# EAGLE design p0tx-001 (EAGLE 9.6.2)
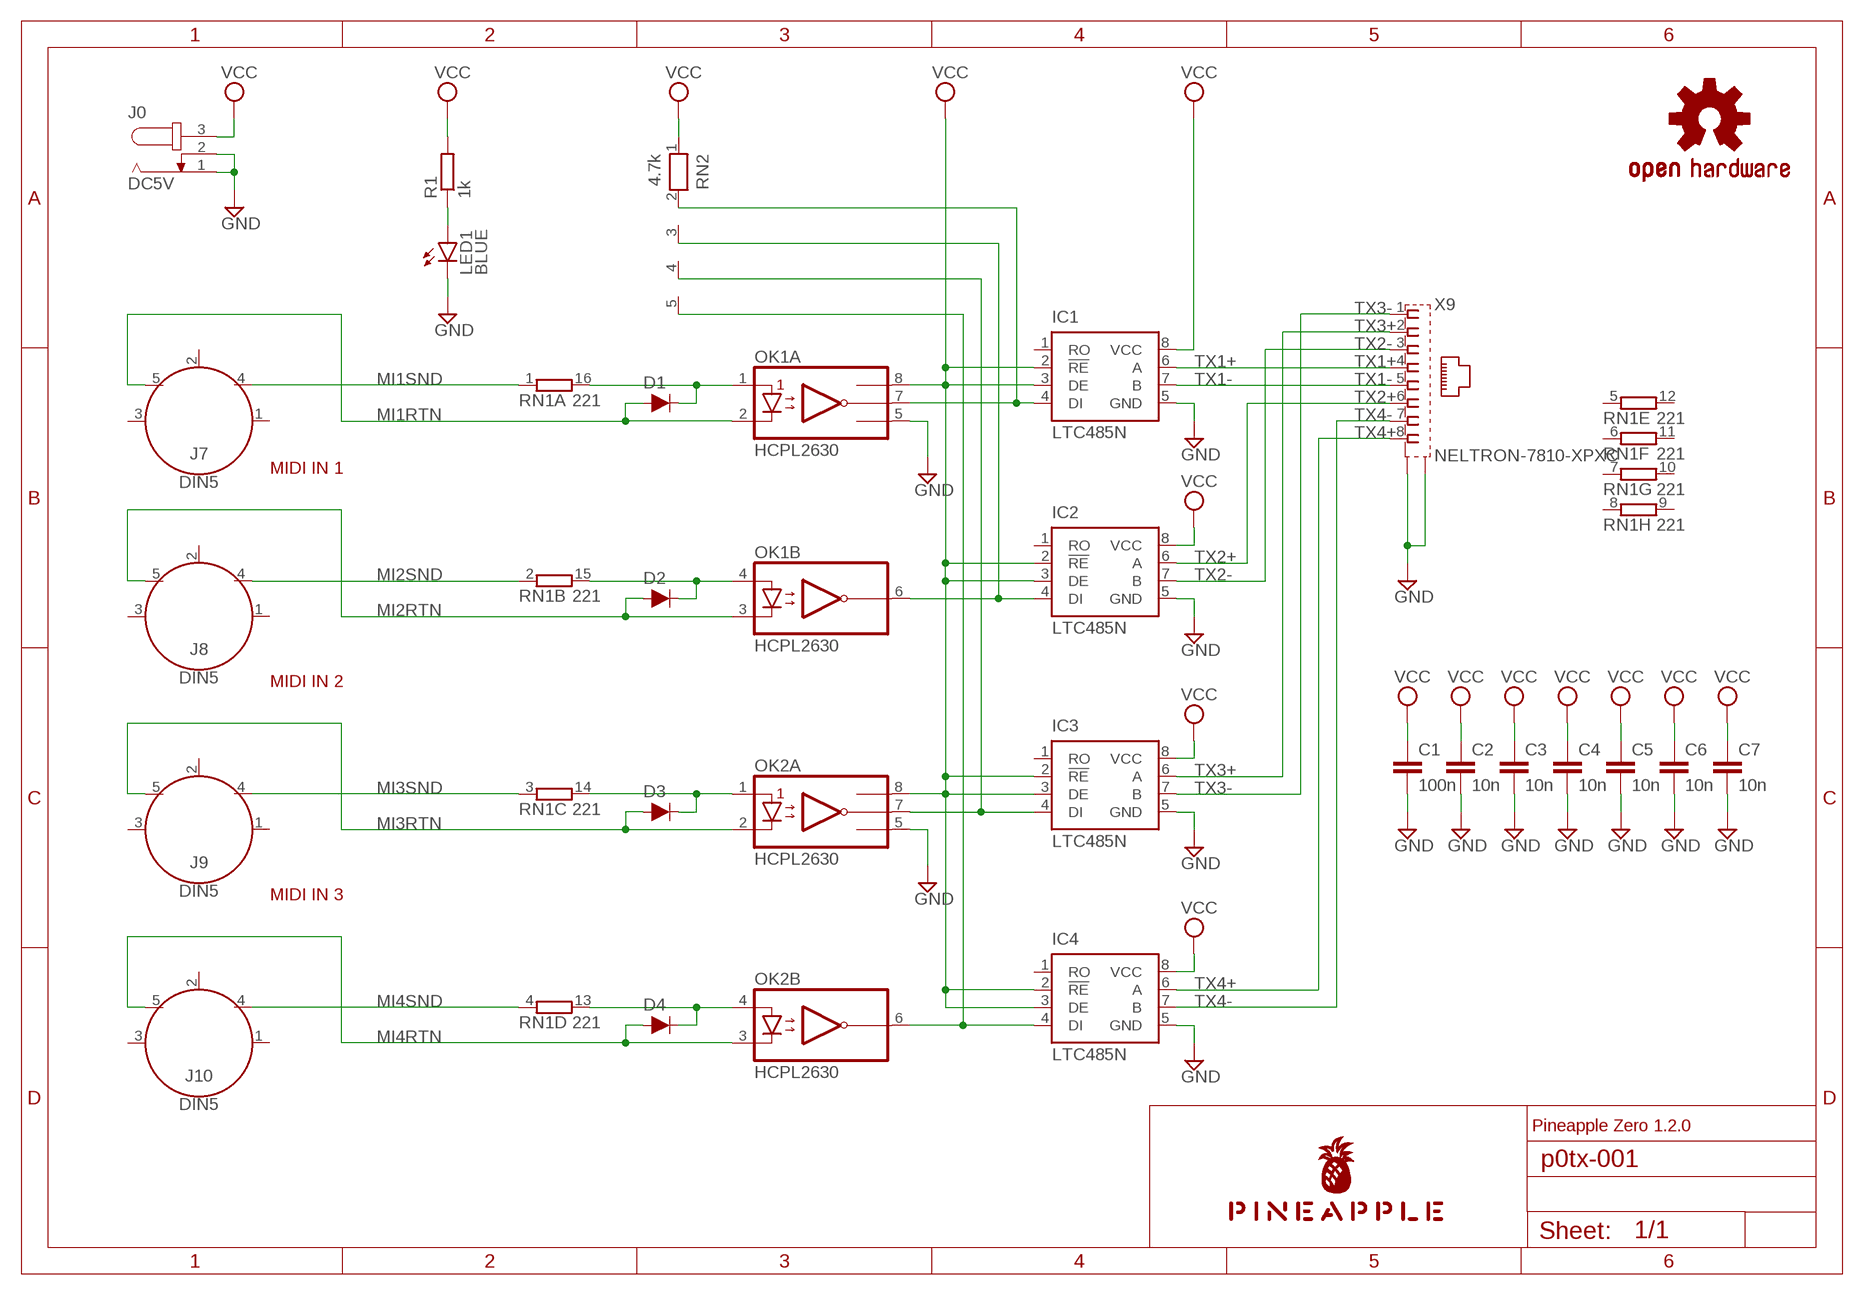
[diagram p0: schematic, sheet 1]

## Parts
C1  100n  C-EU025-024X044  [C025-024X044]
C2  10n  C-EU025-024X044  [C025-024X044]
C3  10n  C-EU025-024X044  [C025-024X044]
C4  10n  C-EU025-024X044  [C025-024X044]
C5  10n  C-EU025-024X044  [C025-024X044]
C6  10n  C-EU025-024X044  [C025-024X044]
C7  10n  C-EU025-024X044  [C025-024X044]
D1  DIODE-1N4148  [DIODE-1N4148]
D2  DIODE-1N4148  [DIODE-1N4148]
D3  DIODE-1N4148  [DIODE-1N4148]
D4  DIODE-1N4148  [DIODE-1N4148]
IC1  LTC485N  [DIL08]
IC2  LTC485N  [DIL08]
IC3  LTC485N  [DIL08]
IC4  LTC485N  [DIL08]
J0  DC5V  JACK-PLUG0  [SPC4077]
J7  DIN5  [DIN5-RA-PTH]
J8  DIN5  [DIN5-RA-PTH]
J9  DIN5  [DIN5-RA-PTH]
J10  DIN5  [DIN5-RA-PTH]
LED1  BLUE  LED3MM  [LED3MM]
LOGO1  OSHW-LOGOS-COPPER  [OSHW-LOGO-S_COPPER]
OK1  HCPL2630  [DIL08]
OK2  HCPL2630  [DIL08]
R1  1k  R-EU_0204/5  [0204/5]
RN1  221  8R-N  [DIL16]
RN2  4.7k  RN04  [RN-5]
U$1  PINEAPPLE450  [PINEAPPLE450]
X9  NELTRON-7810-XPXC  [NELTRON-7810-XPXC-FOOTPRINT]

## Nets
GND [gnd]: C1.2 C2.2 C3.2 C4.2 C5.2 C6.2 C7.2 IC1.5(GND) IC2.5(GND) IC3.5(GND) IC4.5(GND) J0.1 J0.2 LED1.K(C) OK1.5(A:GND) OK2.5(A:GND) X9.S1 X9.S2
MI1RTN: D1.A J7.5 OK1.2(A:C1)
MI1SND: J7.4 RN1.1
MI2RTN: D2.A J8.5 OK1.3(B:C2)
MI2SND: J8.4 RN1.2
MI3RTN: D3.A J9.5 OK2.2(A:C1)
MI3SND: J9.4 RN1.3
MI4RTN: D4.A J10.5 OK2.3(B:C2)
MI4SND: J10.4 RN1.4
MIDIIN: D1.C OK1.1(A:A1) RN1.16
N$1: D4.C OK2.4(B:A2) RN1.13
N$4: LED1.A R1.1
N$5: IC2.4(DI) OK1.6(B:VO2) RN2.3
N$6: IC4.4(DI) OK2.6(B:VO2) RN2.5
N$7: D2.C OK1.4(B:A2) RN1.15
N$8: D3.C OK2.1(A:A1) RN1.14
N$10: IC3.4(DI) OK2.7(A:VO1) RN2.4
TX: IC1.4(DI) OK1.7(A:VO1) RN2.2
TX1+: IC1.6(A) X9.4
TX1-: IC1.7(B) X9.5
TX2+: IC2.6(A) X9.6
TX2-: IC2.7(B) X9.3
TX3+: IC3.6(A) X9.2
TX3-: IC3.7(B) X9.1
TX4+: IC4.6(A) X9.8
TX4-: IC4.7(B) X9.7
VCC [pwr]: C1.1 C2.1 C3.1 C4.1 C5.1 C6.1 C7.1 IC1.2(!RE) IC1.3(DE) IC1.8(VCC) IC2.2(!RE) IC2.3(DE) IC2.8(VCC) IC3.2(!RE) IC3.3(DE) IC3.8(VCC) IC4.2(!RE) IC4.3(DE) IC4.8(VCC) J0.3 OK1.8(A:VCC) OK2.8(A:VCC) R1.2 RN2.1
Unconnected: IC1.1(RO) IC2.1(RO) IC3.1(RO) IC4.1(RO) J7.1 J7.2 J7.3 J8.1 J8.2 J8.3 J9.1 J9.2 J9.3 J10.1 J10.2 J10.3 RN1.5 RN1.6 RN1.7 RN1.8 RN1.9 RN1.10 RN1.11 RN1.12

## Notes on the sheet
- MIDI IN 1
- MIDI IN 2
- MIDI IN 3
- Pineapple Zero 1.2.0

## Library data of the parts
C1-C7 = rcl:C-EU: CAPACITOR, European symbol; SPICEPREFIX: C
D1-D4 = SparkFun-DiscreteSemi:DIODE: Diode These are standard reverse protection diodes and small signal diodes. SparkFun Products: SparkFun SparkPunk Sound Kit <https://www.sparkfun.com/products/11177> SparkFun ESP8266 Thing <https://www.sparkfun.com/products/13231>; PROD_ID: DIO-08378; VALUE: 200mA/100V/1V
IC1-IC4 = linear-technology:LTC485: Low Power RS485 Interface Transceiver Source: http://www.linear.com/pc/downloadDocument.do?navId=H0,C1,C1007,C1017,P2064,D1718; OC_FARNELL: unknown; OC_NEWARK: unknown
J0 = con-jack:JACK-PLUG: DC POWER JACK Power Jack, DC, Right Angle, Through Hole, Rated 5A at 16VDC, PC Terminals Distributor: Farnell (www.Farnell.de) Drawing: 84N1161.pdf / 84N1162.pdf Manufacturer: SPC Technology (www.spctechnology.com) Type: SPC4077 / SPC 4078; OC_FARNELL: unknown; OC_NEWARK: unknown
J7-J10 = SparkFun-Connectors:DIN5: DIN5 Connector - Female Right Angle (frequently used as a MIDI Jack connector) This type of connector and cable is frequently used for transmitting midi data (musical instrument digital interface). It is what you usually see on a keyboard or set of electronic drums. Learn more here <https://en.wikipedia.org/wiki/MIDI>. For more information on the pinout and electrical specifications of MIDI communications, please see the following resource: https://www.midi.org/specifications/item/midi-din-electrical-specification Here is the connector we sell at SparkFun: MIDI Connector - Female Right Angle <https://www.sparkfun.com/products/9536> (PRT-09536) Datasheet <hhttp://www.sparkfun.com/datasheets/Prototyping/Connectors/MIDI-RA.pdf> It is used on this SparkFun product: SparkFun MIDI Shield <https://www.sparkfun.com/products/12898> (DEV-12898); PROD_ID: CONN-09481
LED1 = led:LED: LED OSRAM: - CHIPLED LG R971, LG N971, LY N971, LG Q971, LY Q971, LO R971, LY R971 LH N974, LH R974 LS Q976, LO Q976, LY Q976 LO Q996 - Hyper CHIPLED LW Q18S LB Q993, LB Q99A, LB R99A - SideLED LS A670, LO A670, LY A670, LG A670, LP A670 LB A673, LV A673, LT A673, LW A673 LH A674 LY A675 LS A676, LA A676, LO A676, LY A676, LW A676 LS A679, LY A679, LG A679 - Hyper Micro SIDELED® LS Y876, LA Y876, LO Y876, LY Y876 LT Y87S - SmartLED LW L88C, LW L88S LB L89C, LB L89S, LG L890 LS L89K, LO L89K, LY L89K LS L896, LA L896, LO L896, LY L896 - TOPLED LS T670, LO T670, LY T670, LG T670, LP T670 LSG T670, LSP T670, LSY T670, LOP T670, LYG T670 LG T671, LOG T671, LSG T671 LB T673, LV T673, LT T673, LW T673 LH T674 LS T676, LA T676, LO T676, LY T676, LB T676, LH T676, LSB T676, LW T676 LB T67C, LV T67C, LT T67C, LS T67K, LO T67K, LY T67K, LW E67C LS E67B, LA E67B, LO E67B, LY E67B, LB E67C, LV E67C, LT E67C LW T67C LS T679, LY T679, LG T679 LS T770, LO T770, LY T770, LG T770, LP T770 LB T773, LV T773, LT T773, LW T773 LH T774 LS E675, LA E675, LY E675, LS T675 LS T776, LA T776, LO T776, LY T776, LB T776 LHGB T686 LT T68C, LB T68C - Hyper Mini TOPLED® LB M676 - Mini TOPLED Santana® LG M470 LS M47K, LO M47K, LY M47K Source: http://www.osram.convergy.de LUXEON: - LUMILED® LXK2-PW12-R00, LXK2-PW12-S00, LXK2-PW14-U00, LXK2-PW14-V00 LXK2-PM12-R00, LXK2-PM12-S00, LXK2-PM14-U00 LXK2-PE12-Q00, LXK2-PE12-R00, LXK2-PE12-S00, LXK2-PE14-T00, LXK2-PE14-U00 LXK2-PB12-K00, LXK2-PB12-L00, LXK2-PB12-M00, LXK2-PB14-N00, LXK2-PB14-P00, LXK2-PB14-Q00 LXK2-PR12-L00, LXK2-PR12-M00, LXK2-PR14-Q00, LXK2-PR14-R00 LXK2-PD12-Q00, LXK2-PD12-R00, LXK2-PD12-S00 LXK2-PH12-R00, LXK2-PH12-S00 LXK2-PL12-P00, LXK2-PL12-Q00, LXK2-PL12-R00 Source: www.luxeon.com KINGBRIGHT: KA-3528ASYC Source: www.kingbright.com
LOGO1 = SparkFun-Aesthetics:OSHW-LOGO: Open-Source Hardware (OSHW) Logo This logo indicates the piece of hardware it is found on incorporates a OSHW license and/or adheres to the definition of open source hardware found here: http://freedomdefined.org/OSHW
OK1 OK2 = optocoupler:HCPL2630: HEWLETT PACKARD OPTO COUPLER; MF: AGILENT TECHNOLOGIES; MPN: HCPL-2630-000E; OC_FARNELL: 9994904; OC_NEWARK: 88H7813
R1 = rcl:R-EU_: RESISTOR, European symbol; SPICEPREFIX: R
RN1 = resistor-dil:8R-N: DIL RESISTOR; OC_FARNELL: unknown; OC_NEWARK: unknown
RN2 = resistor-net:RN04: RESISTOR NETWORK; OC_FARNELL: unknown; OC_NEWARK: unknown
U$1 = pineapple:PINEAPPLE450
X9 = con-rj45:NELTRON-7810-XPXC: Mod. Jack, Right Angle, 8 posiotion, 8 contatcs RJ45 Source: GLX-S-88M.pdf

## Net classes
0 default: width 0.152 mm, drill 0.152 mm, clearance 0.152 mm
1 pwr: width 0.305 mm, drill 0.152 mm, clearance 0.152 mm
2 gnd: width 0.305 mm, drill 0.152 mm, clearance 0.152 mm

## Board
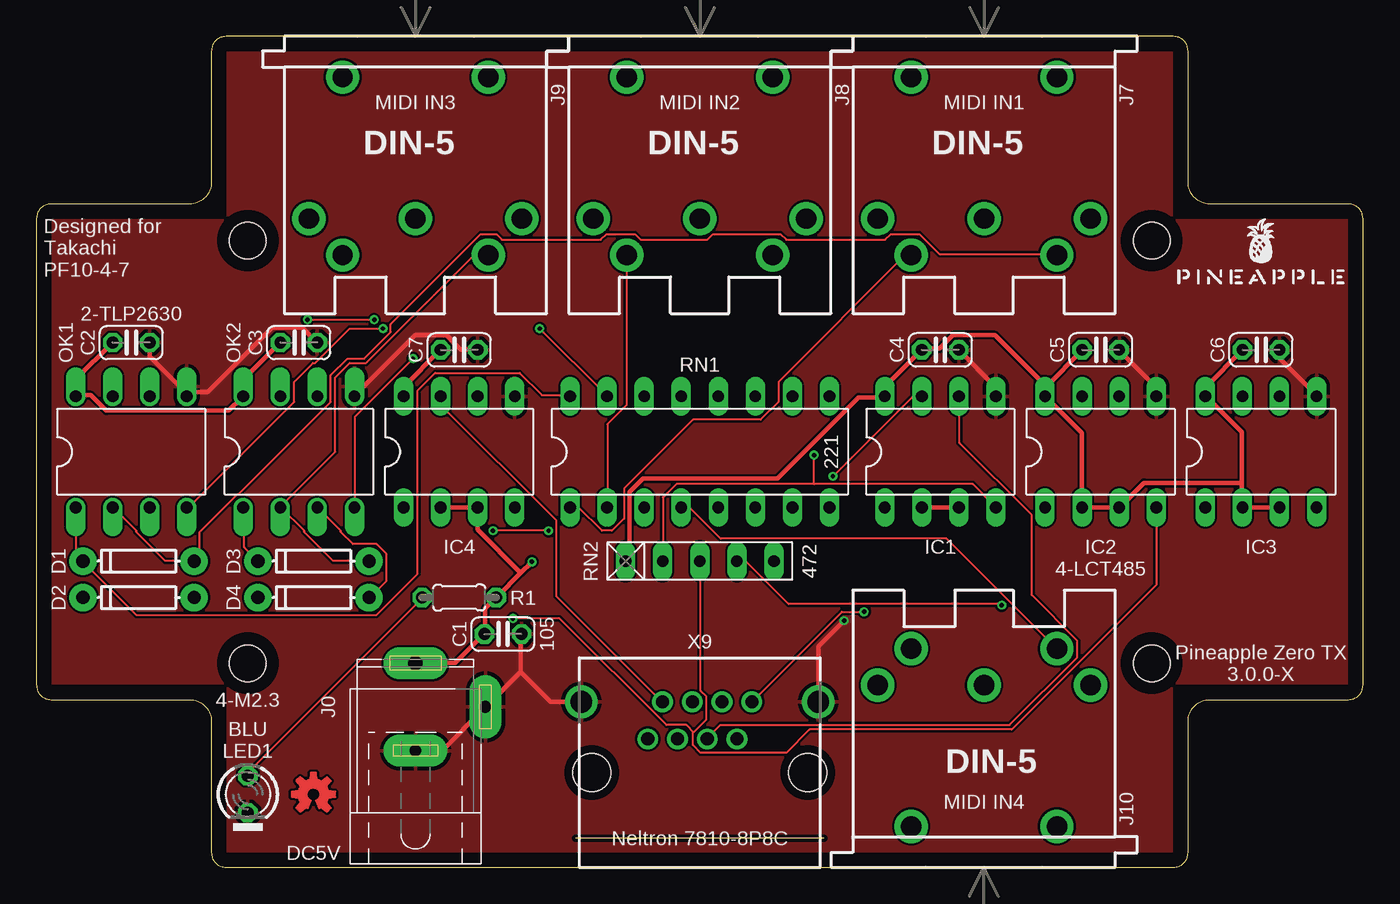
[diagram p1: board, top side]
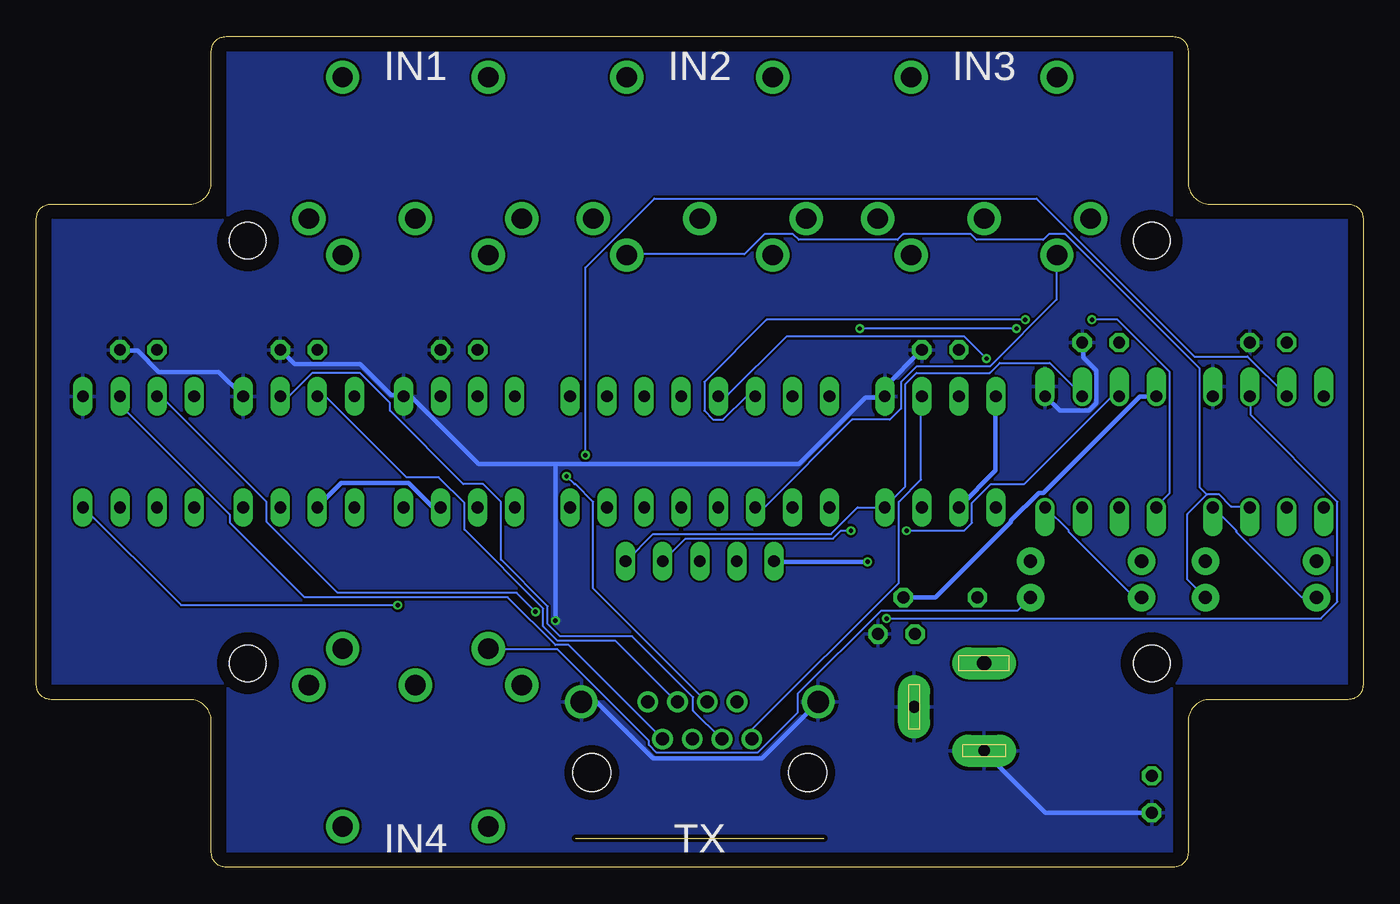
[diagram p2: board, bottom side, seen from below]

Size 91 x 57 mm. Coordinates in mm from the lower left corner, seen from the top.
Outline: 1,11.5 10.5,11.5 arc-90 12,10 12,1 arc90 13,0 78,0 arc90 79,1 79,10 arc-90 80.5,11.5 90,11.5 arc90 91,12.5 91,44.5 arc90 90,45.5 80.5,45.5 arc-90 79,47 79,56 arc90 78,57 13,57 arc90 12,56 12,47 arc-90 10.5,45.5 1,45.5 arc90 0,44.5 0,12.5 arc90 1,11.5
Copper layers (1*16): Top 0.035mm / dielectric 1.5mm / Bottom 0.035mm
Design rules "SeeedStudio_2layer_DRU_no_angle_20140221": minimum track width 6mil, minimum drill 12mil, track to track 6mil, track to pad 6mil, pad to pad 6mil, via to via 6mil, smd to smd 0mil, copper to edge 10mil, drill to drill 10mil, minimum pad ring 10mil, minimum via ring 6mil, stop-mask expansion 2mil, vias tented up to drill 100mil, thermal gap 10mil
Holes 2.5 mm at 14.5,14 76.5,14 76.5,43 14.5,43
tRestrict: area 0,11.5 to 1,45.5; area 0,44.5 to 13,45.5; area 12,44.5 to 13,57; area 12,56 to 79,57; area 78,44.5 to 79,57; area 78,44.5 to 91,45.5; area 90,11.5 to 91,45.5; area 78,11.5 to 91,12.5; area 78,0 to 79,12.5; area 12,0 to 79,1; area 12,0 to 13,12.5; area 0,11.5 to 13,12.5; 4 more areas
bRestrict: area 12,56 to 79,57; area 90,11.5 to 91,45.5; area 12,0 to 79,1; area 0,11.5 to 1,45.5; area 12.5,12 to 16.5,16; area 12,44.5 to 13,57; area 78,44.5 to 79,57; area 12,0 to 13,12.5; area 78,0 to 79,12.5; area 0,44.5 to 13,45.5; area 0,11.5 to 13,12.5; area 78,11.5 to 91,12.5; 4 more areas

### Footprints (pad centres in the part's own frame; a part is rotated, then mirrored left to right if it is on the bottom)
C025-024X044 = drill 0.813 octagon: 1 -1.27,0; 2 1.27,0
DIODE-1N4148 = drill 0.9 pad 1.88: A -3.81,0; C 3.81,0
DIL08 = drill 0.813 long: 1 -3.81,-3.81; 2 -1.27,-3.81; 3 1.27,-3.81; 4 3.81,-3.81; 5 3.81,3.81; 6 1.27,3.81; 7 -1.27,3.81; 8 -3.81,3.81
SPC4077 = drill 0.8 pad 2.184 long: 1 -3,0; 2 0,-4.8 | drill 1 pad 2.184 long: 3 3,0
DIN5-RA-PTH = drill 1.4 pad 2.286: 1 7.3,12.5; 2 0,12.5; 3 -7.3,12.5; 4 5,15; 5 -5,15; 6 -5,2.8; 7 5,2.8
LED3MM = drill 0.813 octagon: A -1.27,0; K 1.27,0
DIL08' = drill 0.813 offset: 1 -3.81,-3.81; 2 -1.27,-3.81; 3 1.27,-3.81; 4 3.81,-3.81; 5 3.81,3.81; 6 1.27,3.81; 7 -1.27,3.81; 8 -3.81,3.81
0204/5 = drill 0.813 octagon: 1 -2.54,0; 2 2.54,0
DIL16 = drill 0.813 long: 1 -8.89,-3.81; 2 -6.35,-3.81; 3 -3.81,-3.81; 4 -1.27,-3.81; 5 1.27,-3.81; 6 3.81,-3.81; 7 6.35,-3.81; 8 8.89,-3.81; 9 8.89,3.81; 10 6.35,3.81; 11 3.81,3.81; 12 1.27,3.81; 13 -1.27,3.81; 14 -3.81,3.81; 15 -6.35,3.81; 16 -8.89,3.81
RN-5 = drill 0.813 long: 1 -5.08,0; 2 -2.54,0; 3 0,0; 4 2.54,0; 5 5.08,0
NELTRON-7810-XPXC-FOOTPRINT = drill 0.9 pad 1.422: 1 -3.57,-4.84; 2 -2.55,-2.3; 3 -1.53,-4.84; 4 -0.51,-2.3; 5 0.51,-4.84; 6 1.53,-2.3; 7 2.55,-4.84; 8 3.57,-2.3 | drill 1.5 pad 2.184: S1 -8.125,-4.84; S2 8.125,-4.84 | hole 2.6: -7.4,0; 7.4,0

### Placement (x,y rotation side)
C1  32,16 0 top
C2  6.5,36 0 top
C3  18,36 0 top
C4  62,35.5 0 top
C5  73,35.5 0 top
C6  84,35.5 0 top
C7  29,35.5 0 top
D1  7,21 180 top
D2  7,18.5 180 top
D3  19,21 180 top
D4  19,18.5 180 top
IC1  62,28.5 0 top
IC2  73,28.5 0 top
IC3  84,28.5 0 top
IC4  29,28.5 0 top
J0  26,11 90 top
J7  65,57 180 top
J8  45.5,57 180 top
J9  26,57 180 top
J10  65,0 0 top
LED1  14.5,5 270 top
LOGO1  19,5 0 top
OK1  HCPL2630  [DIL08']  6.5,28.5 0 top
OK2  HCPL2630  [DIL08']  18,28.5 0 top
R1  29,18.5 0 top
RN1  45.5,28.5 0 top
RN2  45.5,21 0 top
U$1  84,40 0 top
X9  45.5,6.5 180 top

### Tracks (layer width: path | path; a pad name or v marks a point on that pad's centre or on a via)
GND  (via drill 0.3)
  Top 0.305: 33.22,13.41 33.22,15.93 C1.2 | 33.22,13.41 30.86,11.05 J0.2 30.71,10.9 27.81,8 26.06,8 J0.1 | 33.22,13.41 35.28,11.35 37.34,11.35 X9.S2 | C6.2 85.34,35.43 85.34,34.82 87.78,32.38 IC3.5 | IC1.5 65.76,32.38 65.76,32.99 63.32,35.43 C4.2 | IC2.5 76.81,32.38 76.81,32.92 74.3,35.43 C5.2 | C2.2 7.77,35.97 7.77,35.05 10.29,32.54 10.29,32.38 OK1.5 10.36,32.61 11.73,32.61 16.15,37.03 18.21,37.03 19.2,36.04 C3.2 | C7.2 30.25,35.51 29.11,35.51 28.12,36.5 25.98,36.5 21.87,32.38 OK2.5 | v55.4,16.92 53.65,15.16 53.65,11.35 X9.S1
  Bottom 0.305: LED1.K 14.55,3.73 21.79,3.73 25.98,7.92 J0.1 | X9.S1 53.57,11.28 52.5,11.28 48.69,7.47 41.22,7.47 37.41,11.28 X9.S2 | C5.2 74.22,35.43 73.3,34.52 68.81,34.52 66.67,32.38 65.84,32.38 IC1.5 65.68,32.23 65.23,32.23 60.66,27.66 55.4,27.66 | C6.2 85.27,35.43 84.05,35.43 82.6,33.98 78.49,33.98 76.89,32.38 IC2.5 | C7.2 30.33,35.43 32.77,32.99 32.77,32.38 IC4.5 32.92,32.23 34.14,32.23 38.71,27.66 55.4,27.66 | C3.2 19.2,35.97 19.2,34.98 18.29,34.06 18.29,31.85 18.82,31.32 20.8,31.32 21.79,32.31 OK2.5 | 55.4,27.66 v55.4,16.92
  pour Top: -1,-1 92,-1 92,58 -1,58
  pour Bottom: -2,-2 93,-2 93,59 -2,59
MI1RTN
  Top 0.152: OK1.2 5.26,24.69 6.86,23.09 6.86,23.01 8.84,21.03 10.74,21.03 D1.A 10.74,21.11 11.2,21.57 11.2,23.01 13.79,25.6 13.87,25.6 20.19,31.93 20.19,33.76 21.34,34.9 22.48,34.9 24.31,36.73 24.31,37.26 30.48,43.43 31.55,43.43 31.93,43.05 38.71,43.05 39.09,43.43 41.07,43.43 41.45,43.05 46.02,43.05 46.41,43.43 51.05,43.43 51.44,43.05 58.22,43.05 58.6,43.43 60.58,43.43 61.95,42.06 69.95,42.06 J7.5
MI1SND
  Top 0.152: RN1.1 36.65,24.69 37.19,24.69 38.79,23.09 39.47,23.09 40.31,23.93 40.31,25.98 45.03,30.71 49.68,30.71 50.9,31.93 50.9,33.3 59.59,41.99 59.97,41.99 J7.4
MI2RTN
  Bottom 0.152: 10.71,25.57 12.04,24.23 12.04,19.74 10.82,18.52 D2.A | 10.71,25.57 10.67,25.6 9.91,25.6 9.07,24.77 7.77,24.77 OK1.3 | 10.71,25.57 11.2,26.06 11.2,34.21 20.42,43.43 21.57,43.43 21.95,43.05 26.52,43.05 26.9,43.43 31.55,43.43 31.93,43.05 38.71,43.05 39.09,43.43 41.07,43.43 42.44,42.06 50.44,42.06 J8.5
MI2SND
  Top 0.152: RN1.2 39.17,24.77 39.17,30.4 40.46,31.7 40.46,41.99 J8.4
MI3RTN
  Top 0.152: D3.A 22.78,21.03 20.34,21.03 18.36,23.01 18.36,23.09 16.76,24.69 OK2.2 16.76,24.77 20.5,28.5 20.5,33.6 21.49,34.59 22.63,34.59 30.02,41.99 30.94,41.99 J9.5
MI3SND
  Bottom 0.152: RN1.3 41.68,24.77 41,24.77 35.05,30.71 32.46,30.71 31.7,31.47 31.7,33.3 30.63,34.37 25.6,34.37 21.03,38.94 21.03,41.99 J9.4
MI4RTN
  Top 0.152: OK2.3 20.88,23.09 20.88,23.01 21.72,22.17 23.32,22.17 24,21.49 24,19.66 22.86,18.52 D4.A
  Bottom 0.152: J10.5 59.97,14.94 55.24,14.94 49,8.69 49,8.38 48.46,7.85 41.53,7.85 38.79,10.59 38.79,11.89 33.07,17.6 23.7,17.6 22.86,18.44 D4.A
MI4SND
  Top 0.152: RN1.4 44.27,24.69 44.81,24.69 46.94,22.55 62.41,22.55 69.95,15.01 J10.4
MIDIIN
  Top 0.152: OK1.1 2.74,24.69 2.74,21.41 3.12,21.03 D1.C 3.2,20.95 6.86,17.3 23.32,17.3 26.14,20.12 26.14,32.69 27.36,33.91 33.15,33.91 34.67,32.38 36.58,32.38 RN1.16
N$1  (via drill 0.3)
  Top 0.152: v25.83,34.9 21.87,30.94 21.87,24.77 OK2.4
  Bottom 0.152: OK2.4 21.79,24.69 20.19,23.09 20.19,23.01 15.7,18.52 15.24,18.52 D4.C | v25.83,34.9 27.36,36.42 39.55,36.42 43.59,32.38 44.2,32.38 RN1.13
N$4
  Top 0.152: LED1.A 14.55,6.33 14.55,6.55 26.44,18.44 R1.1
N$5  (via drill 0.3)
  Top 0.152: 45.07,9.26 45.03,9.22 45.03,8.38 45.57,7.85 51.44,7.85 53.03,9.45 66.9,9.45 76.81,19.36 IC2.4 | 45.07,9.26 45.95,10.13 45.95,11.73 45.57,12.12 45.57,20.95 RN2.3 | v32.69,17.07 35.89,17.07 43.2,9.75 44.58,9.75 45.07,9.26
  Bottom 0.152: v32.69,17.07 2.9,17.07 1.75,18.21 1.75,25.07 7.7,31.01 7.7,32.31 OK1.6
N$6
  Bottom 0.152: RN2.5 50.52,21.03 48.69,22.86 36.5,22.86 34.67,24.69 32.84,24.69 IC4.4 32.77,24.77 31.39,26.14 31.39,33.15 30.63,33.91 25.6,33.91 24.92,34.59 21.49,34.59 19.28,32.38 OK2.6
N$7  (via drill 0.3)
  Top 0.152: v34.52,36.96 39.09,32.38 RN1.15 | v23.77,36.96 21.49,36.96 19.13,34.59 18.97,34.59 17.68,33.3 17.68,31.93 10.52,24.77 10.36,24.77 OK1.4
  Bottom 0.152: OK1.4 10.29,24.69 8.69,23.09 8.69,23.01 4.19,18.52 3.2,18.52 D2.C | v23.77,36.96 v34.52,36.96
N$8  (via drill 0.3)
  Top 0.152: OK2.1 14.25,24.69 14.25,21.95 15.16,21.03 D3.C | v18.59,37.57 v23.16,37.57
  Bottom 0.152: v23.16,37.57 40.92,37.57 45.19,33.3 45.19,31.32 44.58,30.71 43.89,30.71 42.29,32.31 41.76,32.31 RN1.14 | v18.59,37.57 16.84,37.57 13.26,33.98 13.26,25.68 14.17,24.77 OK2.1
N$10  (via drill 0.3)
  Top 0.152: v66.22,17.98 66.14,18.06 51.59,18.06 48.69,20.95 48.08,20.95 RN2.4 | v35.13,23.09 v31.32,23.09
  Bottom 0.152: v66.22,17.98 81.08,17.98 87.78,24.69 IC3.4 | v31.32,23.09 27.36,23.09 26.82,23.62 26.82,24.99 25.53,26.29 23.24,26.29 17.22,32.31 16.76,32.31 OK2.7 | v35.13,23.09 35.81,23.09 36.35,22.55 46.48,22.55 48.01,21.03 RN2.4
TX  (via drill 0.3)
  Top 0.152: 53.34,26.29 64.24,26.29 65.76,24.77 IC1.4 | 53.34,26.29 43.89,26.29 42.98,25.38 42.98,21.03 RN2.2 | 53.34,26.29 v53.34,28.27
  Bottom 0.152: v53.34,28.27 53.34,41.15 48.62,45.87 22.4,45.87 11.58,35.05 7.92,35.05 5.26,32.38 OK1.7
TX1+
  Top 0.152: IC1.6 63.32,32.31 63.32,29.11 68.28,24.16 68.28,18.67 71.4,15.54 71.4,14.4 66.75,9.75 46.94,9.75 46.02,8.84 X9.4
TX1-  (via drill 0.3)
  Top 0.152: v54.63,26.82 60.12,32.31 60.66,32.31 IC1.7
  Bottom 0.152: v54.63,26.82 54.1,26.29 54.03,26.29 52.81,25.07 52.81,19.13 45.03,11.35 X9.5
TX2+
  Bottom 0.152: IC2.6 74.22,32.38 73.61,32.38 72.08,33.91 68.81,33.91 66.75,31.85 66.75,31.32 61.72,26.29 60.35,26.29 59.13,25.07 59.13,21.11 55.93,17.91 55.93,16.69 55.09,15.85 50.14,15.85 45.95,11.66 45.95,10.74 44.04,8.84 X9.6
TX2-
  Bottom 0.152: IC2.7 71.7,32.31 71.17,32.31 65.61,26.75 63.4,26.75 61.65,24.99 61.65,23.16 56.24,17.75 56.24,16.54 55.24,15.54 51.28,15.54 47.09,11.35 X9.3
TX3+
  Bottom 0.152: IC3.6 85.27,31.7 77.72,24.16 77.72,23.62 72.62,18.52 58.67,18.52 55.4,15.24 54.48,15.24 48.08,8.84 X9.2
TX3-  (via drill 0.3)
  Top 0.152: v56.77,17.53 55.24,17.53 49.07,11.35 X9.1
  Bottom 0.152: v56.77,17.53 58.06,18.82 70.33,18.82 75.21,23.7 75.21,25.07 82.45,32.31 82.68,32.31 IC3.7
TX4+
  Bottom 0.152: IC4.6 30.33,32.31 30.33,26.59 31.85,25.07 31.85,19.51 41.91,9.45 41.91,8.84 X9.8
TX4-
  Top 0.152: IC4.7 27.74,31.7 35.66,23.77 35.66,18.59 42.9,11.35 X9.7
VCC  (via drill 0.3)
  Top 0.305: IC3.3 82.75,24.69 IC3.2 82.68,24.84 82.68,26.36 | C6.1 82.68,35.43 80.24,32.99 80.24,32.38 IC3.8 80.31,32.23 82.68,29.87 82.68,26.36 | IC1.2 63.25,24.69 IC1.3 | IC2.8 69.27,32.38 69.27,32.99 71.7,35.43 C5.1 | IC2.8 69.19,33.07 65.76,36.5 62.87,36.5 61.95,35.59 60.81,35.59 C4.1 60.66,35.43 58.22,32.99 58.22,32.38 IC1.8 58.06,32.23 56.39,32.23 50.83,26.67 41.6,26.67 40.69,25.76 40.69,21.26 40.46,21.03 RN2.1 | IC2.8 69.27,32.23 71.7,29.79 71.7,24.84 IC2.2 71.78,24.69 74.22,24.69 IC2.3 74.37,24.77 75.97,26.36 82.68,26.36 | C2.1 5.18,35.97 2.74,33.53 2.74,32.38 OK1.8 2.9,32.38 3.73,32.38 4.8,31.32 13.18,31.32 14.1,32.23 OK2.8 14.25,32.38 14.25,33.53 16.69,35.97 C3.1 | IC4.8 25.22,32.38 25.22,32.99 27.66,35.43 C7.1 | IC4.2 30.25,24.69 IC4.3 30.25,24.54 30.25,23.16 33.22,20.19 | 33.22,20.19 31.62,18.59 R1.2 31.47,18.44 30.79,17.75 30.79,16 C1.1 30.63,15.93 28.73,14.02 26.06,14.02 J0.3 | 33.22,20.19 v33.98,20.95
  Bottom 0.305: IC1.3 63.32,24.77 63.86,24.77 65.46,26.36 70.1,26.36 71.7,24.77 IC2.2 | v33.98,20.95 40.39,20.95 RN2.1 | IC4.8 25.22,32.31 25.22,27.2 27.66,24.77 IC4.2 | OK2.8 14.25,32.31 15.32,32.31 21.95,25.68 22.25,25.68 24.16,23.77 24.16,23.7 29.34,18.52 31.47,18.52 R1.2

### Text on the board
tNames: MIDI IN3 | MIDI IN2 | MIDI IN1 | Designed for / Takachi / PF10-4-7 | 2-TLP2630 | 221 | 472 | 4-LCT485 | 105 | Pineapple Zero TX / 3.0.0-X | 4-M2.3 | BLU | MIDI IN4 | Neltron 7810-8P8C | DC5V
bNames: IN3 | IN2 | IN1 | TX | IN4